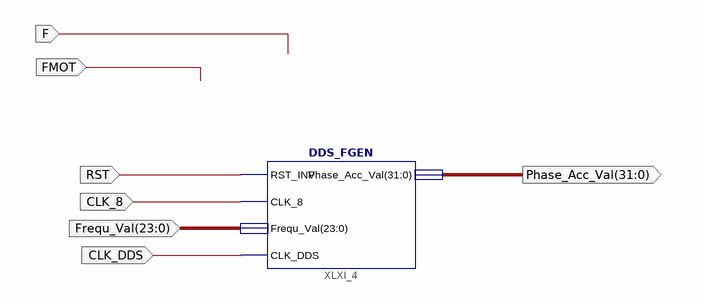
[diagram p0: schematic sheet 1]
// Xilinx ISE schematic DDS.sch (spartan3a) as structural Verilog: 1 symbols, 7 ports
module DDS (
  input  CLK_8,
  input  CLK_DDS,
  input  [23:0] Frequ_Val,
  input  RST,
  input  F,
  input  FMOT,
  output [31:0] Phase_Acc_Val
);

  DDS_FGEN XLXI_4 (
    .CLK_8(CLK_8), .CLK_DDS(CLK_DDS), .Frequ_Val(Frequ_Val), .RST_INV(RST), .Phase_Acc_Val(Phase_Acc_Val));
endmodule
